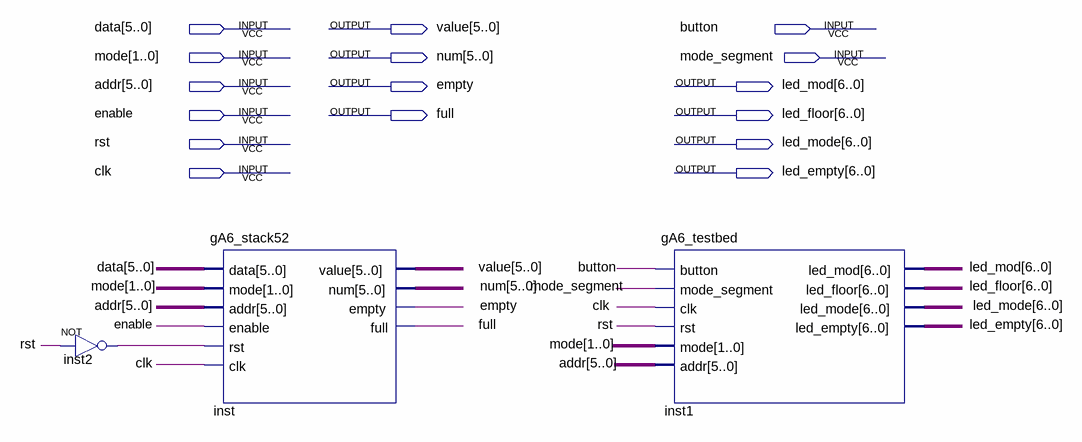
[diagram p0: schematic sheet]
// Quartus schematic gA6_lab3_v1.bdf as structural Verilog: 3 symbols, 16 pins
module gA6_lab3_v1 (
  input  [5:0] data,
  input  button,
  input  [1:0] mode,
  input  mode_segment,
  input  [5:0] addr,
  input  enable,
  input  rst,
  input  clk,
  output [5:0] value,
  output [5:0] num,
  output empty,
  output [6:0] led_mod,
  output full,
  output [6:0] led_floor,
  output [6:0] led_mode,
  output [6:0] led_empty
);

  wire inst2_out;

  not inst2 (inst2_out, rst);
  gA6_stack52 inst (
    .data(data), .mode(mode), .addr(addr), .enable(enable), .rst(inst2_out), .clk(clk), .value(value),
    .num(num), .empty(empty), .full(full));
  gA6_testbed inst1 (
    .button(button), .mode_segment(mode_segment), .clk(clk), .rst(rst), .mode(mode), .addr(addr),
    .led_mod(led_mod), .led_floor(led_floor), .led_mode(led_mode), .led_empty(led_empty));
endmodule
